# Altium schematic sheet SDNL_ARDUINO.SchDoc
size A2
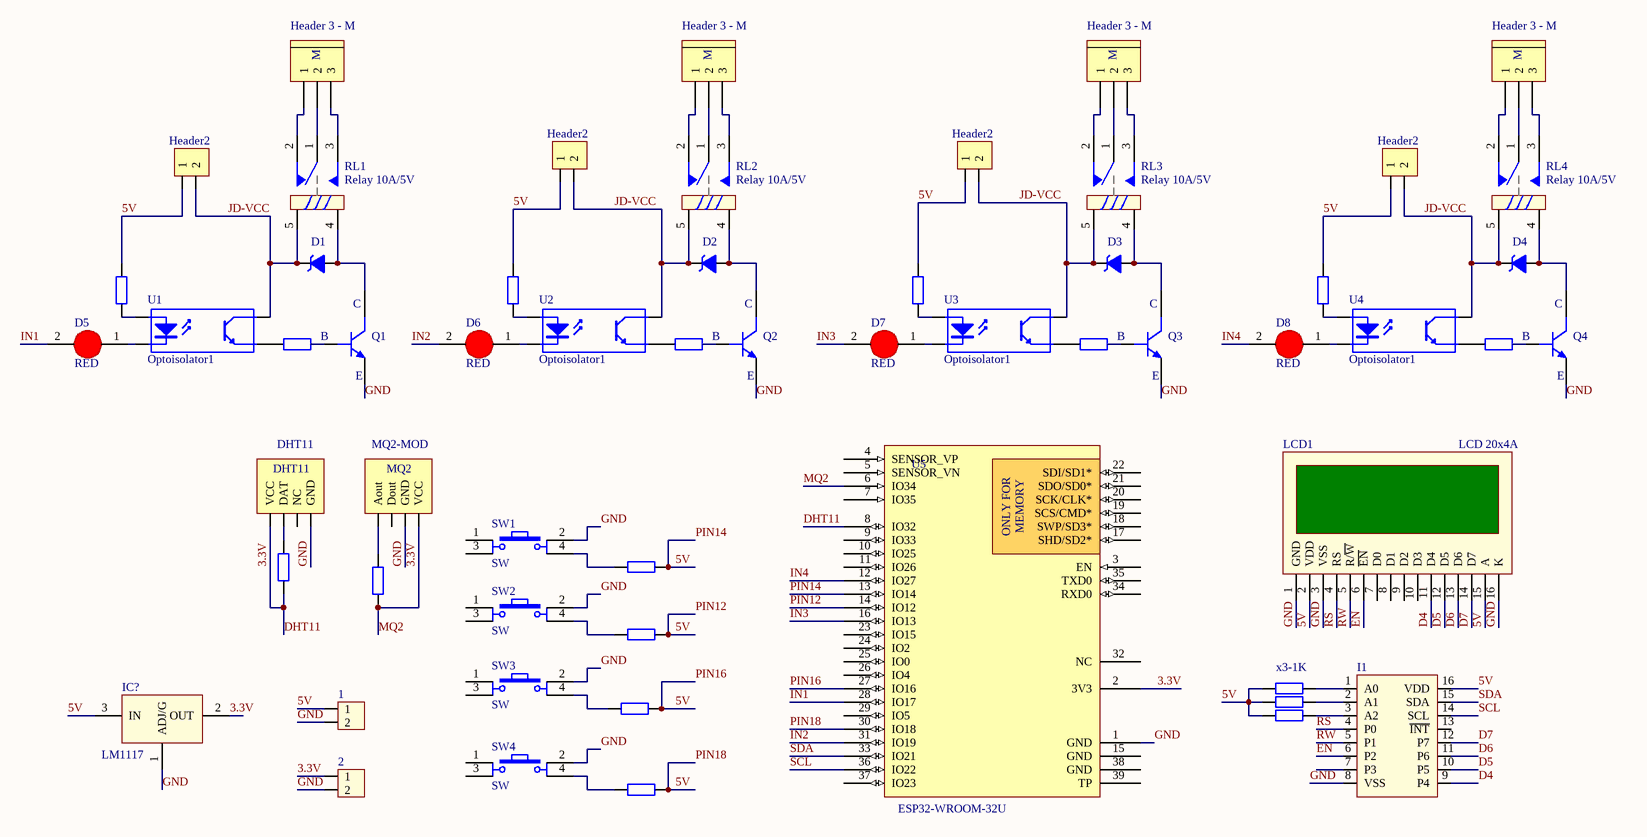
[diagram p0: SDNL_ARDUINO.SchDoc]

## Parts
1  Header 2  [Header_2]  (value not drawn)
2  Header 2  [Header_2]  (value not drawn)
C1  Header2  [HDR2]
C2  Header2  [HDR2]
C3  Header2  [HDR2]
C4  Header2  [HDR2]
C5  DHT11  [DHT11]
C6  MQ2-MOD  [MQ2-MODULE]
D1  3V3  [DZ1A]  (value not drawn)
D2  3V3  [DZ1A]  (value not drawn)
D3  3V3  [DZ1A]  (value not drawn)
D4  3V3  [DZ1A]  (value not drawn)
D5  RED  [LED_0603_RED]
D6  RED  [LED_0603_RED]
D7  RED  [LED_0603_RED]
D8  RED  [LED_0603_RED]
I1  PCF8574 - SO16  (value not drawn)
IC?  LM1117  [SOT223-4N]
LCD1  LCD 20x4A  [LCD20X4A]
P1  Header 3 - M  [Medium - Header 3]
P2  Header 3 - M  [Medium - Header 3]
P3  Header 3 - M  [Medium - Header 3]
P4  Header 3 - M  [Medium - Header 3]
Q1  MMBT2222ALT1G  [SOT23_3]  (value not drawn)
Q2  MMBT2222ALT1G  [SOT23_3]  (value not drawn)
Q3  MMBT2222ALT1G  [SOT23_3]  (value not drawn)
Q4  MMBT2222ALT1G  [SOT23_3]  (value not drawn)
R1  Res2  [RES 1/4W CFR25]  (value not drawn)
R2  Res2  [RES 1/4W CFR25]  (value not drawn)
R3  Res2  [RES 1/4W CFR25]  (value not drawn)
R4  Res2  [RES 1/4W CFR25]  (value not drawn)
R5  Res2  [RES 1/4W CFR25]  (value not drawn)
R6  Res2  [RES 1/4W CFR25]  (value not drawn)
R7  Res2  [RES 1/4W CFR25]  (value not drawn)
R8  Res2  [RES 1/4W CFR25]  (value not drawn)
R9  Res2  [RES 1/4W CFR25]  (value not drawn)
R10  Res2  [RES 1/4W CFR25]  (value not drawn)
R11  Res2  [RES 1/4W CFR25]  (value not drawn)
R12  Res2  [RES 1/4W CFR25]  (value not drawn)
R13  value x3-1K  [RES 1/4W CFR25]  (hidden comment: Res2)
R14  Res2  [RES 1/4W CFR25]  (value not drawn)
R15  Res2  [RES 1/4W CFR25]  (value not drawn)
R16  Res2  [RES 1/4W CFR25]  (value not drawn)
R17  Res2  [RES 1/4W CFR25]  (value not drawn)
RL1  Relay 10A/5V  [RL_SPDT_10A]
RL2  Relay 10A/5V  [RL_SPDT_10A]
RL3  Relay 10A/5V  [RL_SPDT_10A]
RL4  Relay 10A/5V  [RL_SPDT_10A]
SW1  SW  [SW4]
SW2  SW  [SW4]
SW3  SW  [SW4]
SW4  SW  [SW4]
U1  Optoisolator1  [DIP-4]
U2  Optoisolator1  [DIP-4]
U3  Optoisolator1  [DIP-4]
U4  Optoisolator1  [DIP-4]
U5  ESP32-WROOM-32U  [ESP32-WROOM-32U]

## Nets
3.3V: 2.1 C5.1(VCC) C6.4(VCC) IC?.2(OUT) R10.1 R11.1 U5.2(3V3) U5.6(IO34) U5.8(IO32)  [also labelled DHT11, MQ2]
5V: 1.1 C1.1 C2.1 C3.1 C4.1 I1.16(VDD) IC?.3(IN) LCD1.2(VDD) LCD1.15(A) R1.2 R2.2 R3.2 R4.2 R9.1 R12.1 R13.1 R14.1 R15.1 R16.1 R17.1 U5.13(IO14) U5.14(IO12) U5.27(IO16) U5.30(IO18)  [also labelled PIN12, PIN14, PIN16, PIN18]
D4: I1.9(P4) LCD1.11(D4)
D5: I1.10(P5) LCD1.12(D5)
D6: I1.11(P6) LCD1.13(D6)
D7: I1.12(P7) LCD1.14(D7)
EN: I1.6(P2) LCD1.6(~{EN})
GND: 1.2 2.2 C5.4(GND) C6.3(GND) I1.8(VSS) IC?.1(ADJ/G) LCD1.1(GND) LCD1.3(VSS) LCD1.16(K) Q1.2(E) Q2.2(E) Q3.2(E) Q4.2(E) SW1.2 SW2.2 SW3.2 SW4.2 U5.1(GND)
IN1: D5.2(K) U5.28(IO17)
IN2: D6.2(K) U5.31(IO19)
IN3: D7.2(K) U5.16(IO13)
IN4: D8.2(K) U5.12(IO27)
JD-VCC: C1.2 C2.2 C3.2 C4.2 D1.2(K) D2.2(K) D3.2(K) D4.2(K) RL1.5 RL2.5 RL3.5 RL4.5 U1.4(C) U2.4(C) U3.4(C) U4.4(C)
RS: I1.4(P0) LCD1.4(RS)
RW: I1.5(P1) LCD1.5(R/~{W})
SCL: I1.14(SCL) U5.36(IO22)
SDA: I1.15(SDA) U5.33(IO21)
NetC5_2: C5.2(DAT) R10.2
NetC6_1: C6.1(Aout) R11.2
NetD1_1: D1.1(A) Q1.3(C) RL1.4
NetD2_1: D2.1(A) Q2.3(C) RL2.4
NetD3_1: D3.1(A) Q3.3(C) RL3.4
NetD4_1: D4.1(A) Q4.3(C) RL4.4
NetD5_1: D5.1(A) U1.2(K)
NetD6_1: D6.1(A) U2.2(K)
NetD7_1: D7.1(A) U3.2(K)
NetD8_1: D8.1(A) U4.2(K)
NetI1_1: I1.1(A0) R13.2
NetI1_2: I1.2(A1) R14.2
NetI1_3: I1.3(A2) R16.2
NetP1_1: P1.1 RL1.2
NetP1_2: P1.2 RL1.1
NetP1_3: P1.3 RL1.3
NetP2_1: P2.1 RL2.2
NetP2_2: P2.2 RL2.1
NetP2_3: P2.3 RL2.3
NetP3_1: P3.1 RL3.2
NetP3_2: P3.2 RL3.1
NetP3_3: P3.3 RL3.3
NetP4_1: P4.1 RL4.2
NetP4_2: P4.2 RL4.1
NetP4_3: P4.3 RL4.3
NetQ1_1: Q1.1(B) R5.2
NetQ2_1: Q2.1(B) R6.2
NetQ3_1: Q3.1(B) R7.2
NetQ4_1: Q4.1(B) R8.2
NetR1_1: R1.1 U1.1(A)
NetR2_1: R2.1 U2.1(A)
NetR3_1: R3.1 U3.1(A)
NetR4_1: R4.1 U4.1(A)
NetR5_1: R5.1 U1.3(E)
NetR6_1: R6.1 U2.3(E)
NetR7_1: R7.1 U3.3(E)
NetR8_1: R8.1 U4.3(E)
NetR9_2: R9.2 SW1.4
NetR12_2: R12.2 SW2.4
NetR15_2: R15.2 SW3.4
NetR17_2: R17.2 SW4.4

Not connected (* = marked no-connect by the designer): C5 3(NC); C6 2(Dout); I1 7(P3) 13(~{INT}); LCD1 7(D0) 8(D1) 9(D2) 10(D3); SW1 1 3; SW2 1 3; SW3 1 3; SW4 1 3; U5 3(EN) 4(SENSOR_VP) 5(SENSOR_VN) 7(IO35) 9(IO33) 10(IO25) 11(IO26) 15(GND) 17(SHD/SD2*) 18(SWP/SD3*) 19(SCS/CMD*) 20(SCK/CLK*) 21(SDO/SD0*) 22(SDI/SD1*) 23(IO15) 24(IO2) 25(IO0) 26(IO4) 29(IO5) 32(NC) 34(RXD0) 35(TXD0) 37(IO23) 38(GND) 39(TP)

## Notes on the sheet
- (in symbol ESP32-WROOM-32U) ONLY FOR; MEMORY
- (in symbol Header 3 - M) M
- (in symbol MQ2-MOD) MQ2

## Library data of the parts
1 2 = Header2: Value: Header 2
C1-C4 = Header2: Header IDC, 2 x 1 Pin Vertical 2.54mm Pitch (Non-Boxed, Male); Manufacturer: W¨¹rth Elektronik eiSos GmbH; partNo: 613002143121; ComponentLink1 Description: Manufacturer; ComponentLink2 Description: Datasheet; NoPins: 02; Created Date: 29 March 2013; ComponentLink1URL: http://www.we-online.com; ComponentLink2URL: http://katalog.we-online.de/em/datasheet/6130xx143121.pdf; Created by: Karrer Zheng
C5 = DHT11: Manufacturer: W¨¹rth Elektronik eiSos GmbH; partNo: 613004143121; ComponentLink1 Description: Manufacturer; ComponentLink2 Description: Datasheet; NoPins: 04; Created Date: 29 March 2013; ComponentLink1URL: http://www.we-online.com; ComponentLink2URL: http://katalog.we-online.de/em/datasheet/6130xx143121.pdf; Created by: Karrer Zheng
C6 = MQ2-MOD: Manufacturer: W¨¹rth Elektronik eiSos GmbH; partNo: 613004143121; ComponentLink1 Description: Manufacturer; ComponentLink2 Description: Datasheet; NoPins: 04; Created Date: 29 March 2013; ComponentLink1URL: http://www.we-online.com; ComponentLink2URL: http://katalog.we-online.de/em/datasheet/6130xx143121.pdf; Created by: Karrer Zheng
D1-D4 = DZ: Diode Zenner; Value: 3v3
D5-D8 = LED RED 0603: LED RED 0603 SMD; Solder: SMT; Value: RED; Category: *
I1 = PCF8574: PCF8574_PCF8574A 8bit expander for I2C - SO16
IC? = LM1117: Available in 1.8V, 2.5V, 2.85V, 3.3V, 5V, and  Adjustable Versions; Value: LM317
LCD1 = LCD20x4A: LCD dipslay 20 char, 4 line; Value: Jum 40; Value: LCD 20x4A
P1-P4 = Header 3 - M: Header, 3-Pin, Medium; LatestRevisionDate: 17-Jul-2002; LatestRevisionNote: Re-released for DXP Platform.; Publisher: Altium Limited
Q1-Q4 = MMBT2222ALT1G: TRANS NPN 40V 0.6A SOT23; Solder: SMT; MPN: MMBT2222ALT1G; Value: MMBT2222ALT1G
R1-R12 R14-R17 = Res2: Resistor; Value: x3-1K; Published: 8-Jun-2000; LatestRevisionDate: 17-Jul-2002; LatestRevisionNote: Re-released for DXP Platform.; PackageReference: AXIAL-0.4; Publisher: Altium Limited; PackageDescription: Axial Device, Thru-Hole; 2 Leads; 0.4 in Pin Spacing
R13 = Res2: Resistor; Published: 8-Jun-2000; LatestRevisionDate: 17-Jul-2002; LatestRevisionNote: Re-released for DXP Platform.; PackageReference: AXIAL-0.4; Publisher: Altium Limited; PackageDescription: Axial Device, Thru-Hole; 2 Leads; 0.4 in Pin Spacing
RL1-RL4 = Relay 1: Relay SPDT,10A - 12VDC 5 Pin; Value: Relay SPDT, 10A, 12V
SW1-SW4 = SW4: Switch button 4 pin; Value: Button chip 4 pin
U1-U4 = Optoisolator1: 4-Pin Phototransistor Optocoupler; Published: 24-Mar-1999; LatestRevisionDate: 04-Mar-2005; LatestRevisionNote: Sch pins 3 & 4 Swapped.; DatasheetVersion: Nov-2003; PackageReference: DIP-4; Publisher: Altium Limited
U5 = ESP32-WROOM-32U: Wi-Fi/BT BLE Module ESP32-D0WD; MFR: Espressif; Solder: SMT; Price: None; Value: ESP32-WROOM-32U; Category: MODULE; MPN: ESP32-WROOM-32U; PinCount: 40